# Altium schematic sheet MCU - STM32F407VGT6.SchDoc
size A4; SheetNumber: 2; SheetTotal: 8
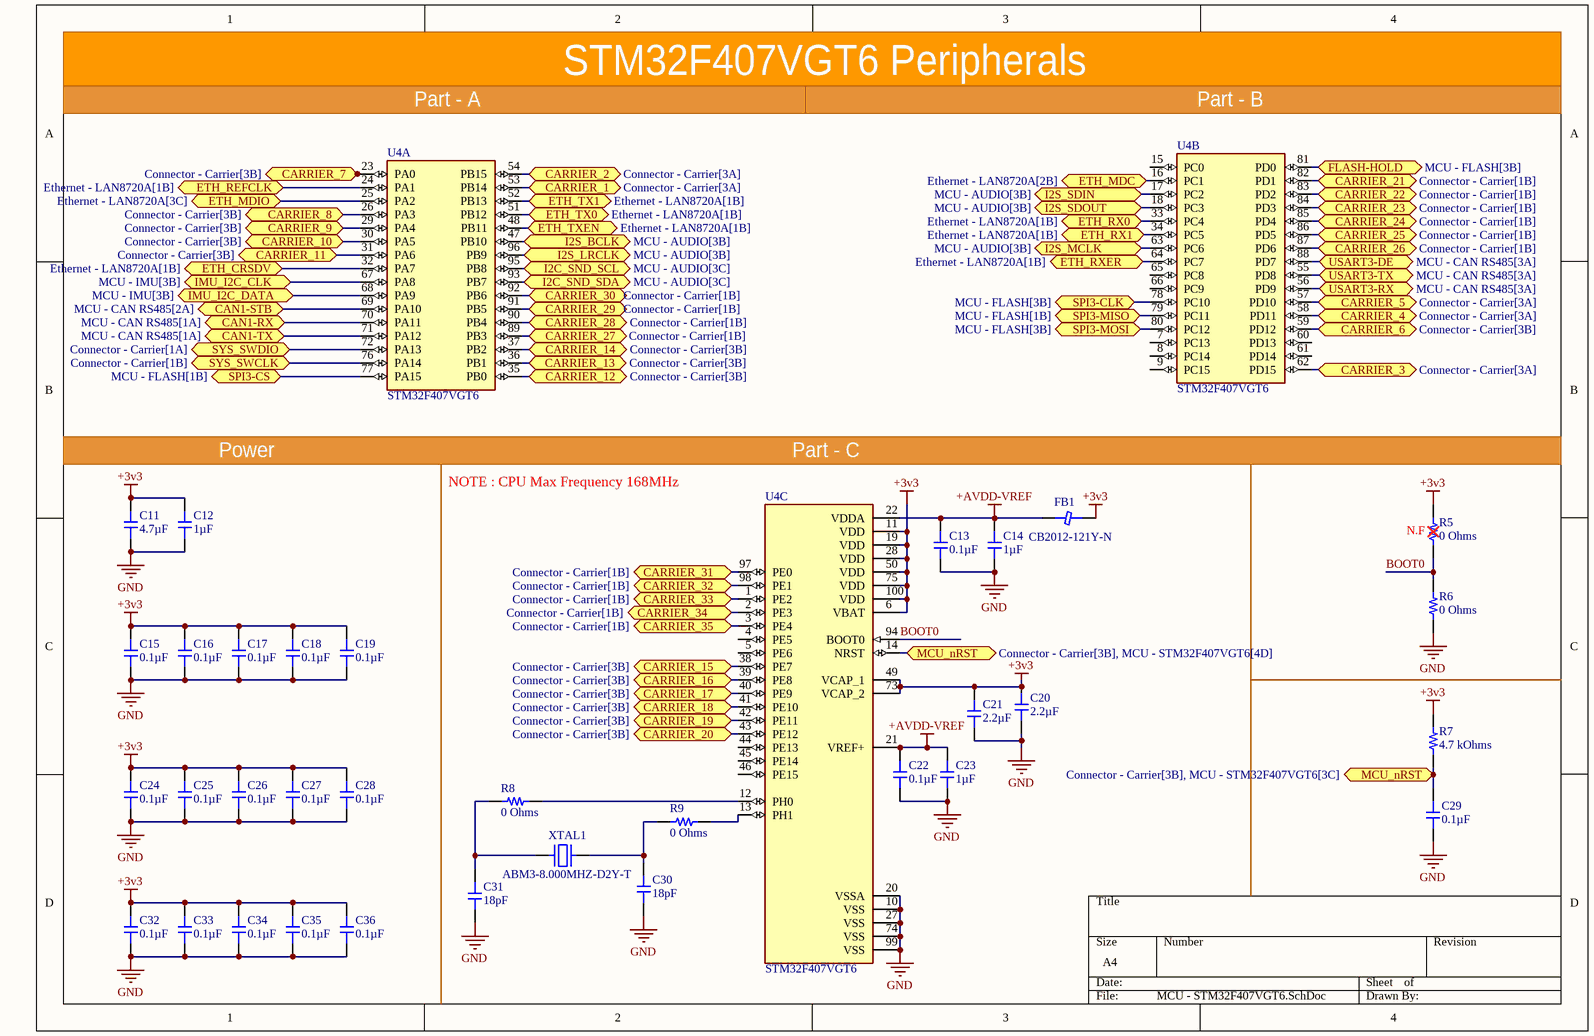
[diagram p0: MCU - STM32F407VGT6.SchDoc]

## Parts
C11  4.7µF  [0603_Footprint]
C12  1µF  [0603_Footprint]
C13  0.1µF  [0603_Footprint]
C14  1µF  [0603_Footprint]
C15  0.1µF  [0603_Footprint]
C16  0.1µF  [0603_Footprint]
C17  0.1µF  [0603_Footprint]
C18  0.1µF  [0603_Footprint]
C19  0.1µF  [0603_Footprint]
C20  2.2µF  [0603_Footprint]
C21  2.2µF  [0603_Footprint]
C22  0.1µF  [0603_Footprint]
C23  1µF  [0603_Footprint]
C24  0.1µF  [0603_Footprint]
C25  0.1µF  [0603_Footprint]
C26  0.1µF  [0603_Footprint]
C27  0.1µF  [0603_Footprint]
C28  0.1µF  [0603_Footprint]
C29  0.1µF  [0603_Footprint]
C30  18pF  [0603_Footprint]
C31  18pF  [0603_Footprint]
C32  0.1µF  [0603_Footprint]
C33  0.1µF  [0603_Footprint]
C34  0.1µF  [0603_Footprint]
C35  0.1µF  [0603_Footprint]
C36  0.1µF  [0603_Footprint]
FB1  CB2012-121Y-N  [Inductor-0603]
R5  0 Ohms  [0603_RES]
R6  0 Ohms  [0603_RES]
R7  4.7 kOhms  [0603_RES]
R8  0 Ohms  [0603_RES]
R9  0 Ohms  [0603_RES]
U4  STM32F407VGT6  [QFP50P1600X1600X160-100N]  (parts A,B,C of 3)
XTAL1  ABM3-8.000MHZ-D2Y-T  [ABM3]

## Ports
CAN1-RX (bidir, see MCU - CAN RS485[1A]), CAN1-STB (bidir, see MCU - CAN RS485[2A]), CAN1-TX (bidir, see MCU - CAN RS485[1A]), CARRIER_1 (bidir, see Connector - Carrier[3A]), CARRIER_2 (bidir, see Connector - Carrier[3A]), CARRIER_3 (bidir, see Connector - Carrier[3A]), CARRIER_4 (bidir, see Connector - Carrier[3A]), CARRIER_5 (bidir, see Connector - Carrier[3A]), CARRIER_6 (bidir, see Connector - Carrier[3B]), CARRIER_7 (bidir, see Connector - Carrier[3B]), CARRIER_8 (bidir, see Connector - Carrier[3B]), CARRIER_9 (bidir, see Connector - Carrier[3B]), CARRIER_10 (bidir, see Connector - Carrier[3B]), CARRIER_11 (bidir, see Connector - Carrier[3B]), CARRIER_12 (bidir, see Connector - Carrier[3B]), CARRIER_13 (bidir, see Connector - Carrier[3B]), CARRIER_14 (bidir, see Connector - Carrier[3B]), CARRIER_15 (bidir, see Connector - Carrier[3B]), CARRIER_16 (bidir, see Connector - Carrier[3B]), CARRIER_17 (bidir, see Connector - Carrier[3B]), CARRIER_18 (bidir, see Connector - Carrier[3B]), CARRIER_19 (bidir, see Connector - Carrier[3B]), CARRIER_20 (bidir, see Connector - Carrier[3B]), CARRIER_21 (bidir, see Connector - Carrier[1B]), CARRIER_22 (bidir, see Connector - Carrier[1B]), CARRIER_23 (bidir, see Connector - Carrier[1B]), CARRIER_24 (bidir, see Connector - Carrier[1B]), CARRIER_25 (bidir, see Connector - Carrier[1B]), CARRIER_26 (bidir, see Connector - Carrier[1B]), CARRIER_27 (bidir, see Connector - Carrier[1B]), CARRIER_28 (bidir, see Connector - Carrier[1B]), CARRIER_29 (bidir, see Connector - Carrier[1B]), CARRIER_30 (bidir, see Connector - Carrier[1B]), CARRIER_31 (bidir, see Connector - Carrier[1B]), CARRIER_32 (bidir, see Connector - Carrier[1B]), CARRIER_33 (bidir, see Connector - Carrier[1B]), CARRIER_34 (bidir, see Connector - Carrier[1B]), CARRIER_35 (bidir, see Connector - Carrier[1B]), ETH_CRSDV (bidir, see Ethernet - LAN8720A[1B]), ETH_MDC (bidir, see Ethernet - LAN8720A[2B]), ETH_MDIO (bidir, see Ethernet - LAN8720A[3C]), ETH_REFCLK (bidir, see Ethernet - LAN8720A[1B]), ETH_RX0 (bidir, see Ethernet - LAN8720A[1B]), ETH_RX1 (bidir, see Ethernet - LAN8720A[1B]), ETH_RXER (bidir, see Ethernet - LAN8720A[1B]), ETH_TX0 (bidir, see Ethernet - LAN8720A[1B]), ETH_TX1 (bidir, see Ethernet - LAN8720A[1B]), ETH_TXEN (bidir, see Ethernet - LAN8720A[1B]), FLASH-HOLD (bidir, see MCU - FLASH[3B]), I2C_SND_SCL (bidir, see MCU - AUDIO[3C]), I2C_SND_SDA (bidir, see MCU - AUDIO[3C]), I2S_BCLK (bidir, see MCU - AUDIO[3B]), I2S_LRCLK (bidir, see MCU - AUDIO[3B]), I2S_MCLK (bidir, see MCU - AUDIO[3B]), I2S_SDIN (bidir, see MCU - AUDIO[3B]), I2S_SDOUT (bidir, see MCU - AUDIO[3B]), IMU_I2C_CLK (bidir, see MCU - IMU[3B]), IMU_I2C_DATA (bidir, see MCU - IMU[3B]), MCU_nRST (bidir, see Connector - Carrier[3B], MCU - STM32F407VGT6[3C]), MCU_nRST (bidir, see Connector - Carrier[3B], MCU - STM32F407VGT6[4D]), SPI3-CLK (bidir, see MCU - FLASH[3B]), SPI3-CS (bidir, see MCU - FLASH[1B]), SPI3-MISO (bidir, see MCU - FLASH[1B]), SPI3-MOSI (bidir, see MCU - FLASH[3B]), SYS_SWCLK (bidir, see Connector - Carrier[1B]), SYS_SWDIO (bidir, see Connector - Carrier[1A]), USART3-DE (bidir, see MCU - CAN RS485[3A]), USART3-RX (bidir, see MCU - CAN RS485[3A]), USART3-TX (bidir, see MCU - CAN RS485[3A])

## Nets
+3v3: C11.1 C12.1 C15.1 C16.1 C17.1 C18.1 C19.1 C20.1 C21.1 C24.1 C25.1 C26.1 C27.1 C28.1 C32.1 C33.1 C34.1 C35.1 C36.1 FB1.2 R5.2 R7.2 U4.6(VBAT) U4.11(VDD) U4.19(VDD) U4.28(VDD) U4.49(VCAP_1) U4.50(VDD) U4.73(VCAP_2) U4.75(VDD) U4.100(VDD)
+AVDD-VREF: C13.1 C14.1 C22.1 C23.1 FB1.1 U4.21(VREF+) U4.22(VDDA)
GND: C11.2 C12.2 C13.2 C14.2 C15.2 C16.2 C17.2 C18.2 C19.2 C20.2 C21.2 C22.2 C23.2 C24.2 C25.2 C26.2 C27.2 C28.2 C29.2 C30.2 C31.2 C32.2 C33.2 C34.2 C35.2 C36.2 R6.1 U4.10(VSS) U4.20(VSSA) U4.27(VSS) U4.74(VSS) U4.99(VSS)
BOOT0: R5.1 R6.2 U4.94(BOOT0)
CAN1-RX: U4.70(PA11) ; port CAN1-RX
CAN1-STB: U4.69(PA10) ; port CAN1-STB
CAN1-TX: U4.71(PA12) ; port CAN1-TX
CARRIER_1: U4.53(PB14) ; port CARRIER_1
CARRIER_2: U4.54(PB15) ; port CARRIER_2
CARRIER_3: U4.62(PD15) ; port CARRIER_3
CARRIER_4: U4.58(PD11) ; port CARRIER_4
CARRIER_5: U4.57(PD10) ; port CARRIER_5
CARRIER_6: U4.59(PD12) ; port CARRIER_6
CARRIER_7: U4.23(PA0) ; port CARRIER_7
CARRIER_8: U4.26(PA3) ; port CARRIER_8
CARRIER_9: U4.29(PA4) ; port CARRIER_9
CARRIER_10: U4.30(PA5) ; port CARRIER_10
CARRIER_11: U4.31(PA6) ; port CARRIER_11
CARRIER_12: U4.35(PB0) ; port CARRIER_12
CARRIER_13: U4.36(PB1) ; port CARRIER_13
CARRIER_14: U4.37(PB2) ; port CARRIER_14
CARRIER_15: U4.38(PE7) ; port CARRIER_15
CARRIER_16: U4.39(PE8) ; port CARRIER_16
CARRIER_17: U4.40(PE9) ; port CARRIER_17
CARRIER_18: U4.41(PE10) ; port CARRIER_18
CARRIER_19: U4.42(PE11) ; port CARRIER_19
CARRIER_20: U4.43(PE12) ; port CARRIER_20
CARRIER_21: U4.82(PD1) ; port CARRIER_21
CARRIER_22: U4.83(PD2) ; port CARRIER_22
CARRIER_23: U4.84(PD3) ; port CARRIER_23
CARRIER_24: U4.85(PD4) ; port CARRIER_24
CARRIER_25: U4.86(PD5) ; port CARRIER_25
CARRIER_26: U4.87(PD6) ; port CARRIER_26
CARRIER_27: U4.89(PB3) ; port CARRIER_27
CARRIER_28: U4.90(PB4) ; port CARRIER_28
CARRIER_29: U4.91(PB5) ; port CARRIER_29
CARRIER_30: U4.92(PB6) ; port CARRIER_30
CARRIER_31: U4.97(PE0) ; port CARRIER_31
CARRIER_32: U4.98(PE1) ; port CARRIER_32
CARRIER_33: U4.1(PE2) ; port CARRIER_33
CARRIER_34: U4.2(PE3) ; port CARRIER_34
CARRIER_35: U4.3(PE4) ; port CARRIER_35
ETH_CRSDV: U4.32(PA7) ; port ETH_CRSDV
ETH_MDC: U4.16(PC1) ; port ETH_MDC
ETH_MDIO: U4.25(PA2) ; port ETH_MDIO
ETH_REFCLK: U4.24(PA1) ; port ETH_REFCLK
ETH_RX0: U4.33(PC4) ; port ETH_RX0
ETH_RX1: U4.34(PC5) ; port ETH_RX1
ETH_RXER: U4.64(PC7) ; port ETH_RXER
ETH_TX0: U4.51(PB12) ; port ETH_TX0
ETH_TX1: U4.52(PB13) ; port ETH_TX1
ETH_TXEN: U4.48(PB11) ; port ETH_TXEN
FLASH-HOLD: U4.81(PD0) ; port FLASH-HOLD
I2C_SND_SCL: U4.95(PB8) ; port I2C_SND_SCL
I2C_SND_SDA: U4.93(PB7) ; port I2C_SND_SDA
I2S_BCLK: U4.47(PB10) ; port I2S_BCLK
I2S_LRCLK: U4.96(PB9) ; port I2S_LRCLK
I2S_MCLK: U4.63(PC6) ; port I2S_MCLK
I2S_SDIN: U4.17(PC2) ; port I2S_SDIN
I2S_SDOUT: U4.18(PC3) ; port I2S_SDOUT
IMU_I2C_CLK: U4.67(PA8) ; port IMU_I2C_CLK
IMU_I2C_DATA: U4.68(PA9) ; port IMU_I2C_DATA
MCU_nRST: C29.1 R7.1 U4.14(NRST) ; port MCU_nRST
SPI3-CLK: U4.78(PC10) ; port SPI3-CLK
SPI3-CS: U4.77(PA15) ; port SPI3-CS
SPI3-MISO: U4.79(PC11) ; port SPI3-MISO
SPI3-MOSI: U4.80(PC12) ; port SPI3-MOSI
SYS_SWCLK: U4.76(PA14) ; port SYS_SWCLK
SYS_SWDIO: U4.72(PA13) ; port SYS_SWDIO
USART3-DE: U4.88(PD7) ; port USART3-DE
USART3-RX: U4.56(PD9) ; port USART3-RX
USART3-TX: U4.55(PD8) ; port USART3-TX
NetC30_1: C30.1 R9.1 XTAL1.2
NetC31_1: C31.1 R8.1 XTAL1.1
NetR8_2: R8.2 U4.12(PH0)
NetR9_2: R9.2 U4.13(PH1)

Not connected (* = marked no-connect by the designer): U4 4(PE5) 5(PE6) 7(PC13) 8(PC14) 9(PC15) 15(PC0) 44(PE13) 45(PE14) 46(PE15) 60(PD13) 61(PD14) 65(PC8) 66(PC9)

## Notes on the sheet
- Part - A
- STM32F407VGT6 Peripherals
- Part - B
- Power
- NOTE : CPU Max Frequency 168MHz
- Part - C
- (near R5) N.F

## Library data of the parts
C11 = 4.7uF 0603 Surface Capacitor
C12 C14 C23 = 1uF 0603 Surface Capacitor
C13 C15-C19 C22 C24-C29 C32-C36 = 0.1uF 0603 Surface Capacitor
C20 C21 = 2.2uF 0603 Surface Capacitor
C30 C31 = 18pF 0603 Surface Capacitor
R5 R6 R8 R9 = 0 Ohm 0603
R7 = 4.7 kOhms 0603
U4 = STM32F407VGT6: STM32 Series 32-bit 1 MB Flash 192 kB RAM ARM Based Microcontroller - LQFP-100; Price: None; Value: *; MP: STM32F407VGT6; Package: None; Availability: Unavailable
XTAL1 = ABM3-8.000MHZ-D2Y-T: Crystal or Oscillator; Manufacturer_Name: ABRACON; Datasheet Link: https://abracon.com/Resonators/abm3.pdf; Height: 1.3mm; Manufacturer_Part_Number: ABM3-8.000MHZ-D2Y-T; Mouser Part Number: 815-ABM3-8-D2Y-T; Mouser Price/Stock: https://www.mouser.co.uk/ProductDetail/ABRACON/ABM3-8.000MHZ-D2Y-T?qs=ihRgKfnEsN4giUXjc3yS1g%3D%3D; Arrow Part Number: ABM3-8.000MHZ-D2Y-T; Arrow Price/Stock: https://www.arrow.com/en/products/abm3-8.000mhz-d2y-t/abracon?region=europe